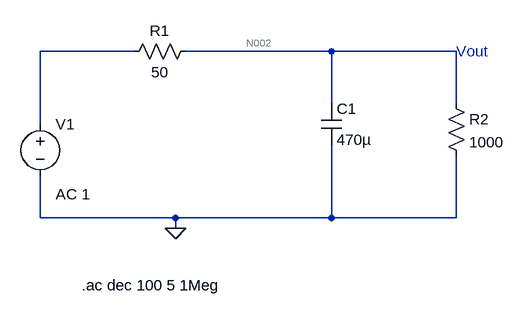
[diagram p0: schematic Shunt_filter.asc]
Shunt_filter.asc, the LTspice schematic file:
Version 4
SHEET 1 1188 680
WIRE 608 -16 464 -16
WIRE 912 -16 688 -16
WIRE 1104 -16 912 -16
WIRE 912 64 912 -16
WIRE 1104 64 1104 -16
WIRE 464 96 464 -16
WIRE 464 240 464 176
WIRE 672 240 464 240
WIRE 912 240 912 128
WIRE 912 240 672 240
WIRE 1104 240 1104 144
WIRE 1104 240 912 240
WIRE 672 256 672 240
FLAG 672 256 0
SYMBOL res 704 -32 R90
WINDOW 0 0 56 VBottom 2
WINDOW 3 32 56 VTop 2
SYMATTR InstName R1
SYMATTR Value 50
SYMBOL res 1088 48 R0
SYMATTR InstName R2
SYMATTR Value 1000
SYMBOL voltage 464 80 R0
WINDOW 123 24 124 Left 2
WINDOW 39 0 0 Left 0
SYMATTR InstName V1
SYMATTR Value ""
SYMATTR Value2 AC 1
SYMBOL cap 896 64 R0
SYMATTR InstName C1
SYMATTR Value 470µ
TEXT 1104 -16 Left 2 ;Vout
TEXT 528 344 Left 2 !.ac dec 100 5 1Meg

The netlist it stands for:
* Shunt_filter.asc
R1 N002 N001 50
R2 N002 0 1000
V1 N001 0 AC 1
C1 N002 0 470µ
* Vout
.ac dec 100 5 1Meg
.backanno
.end

* Results of the author's LTspice run, read from the files saved beside the schematic
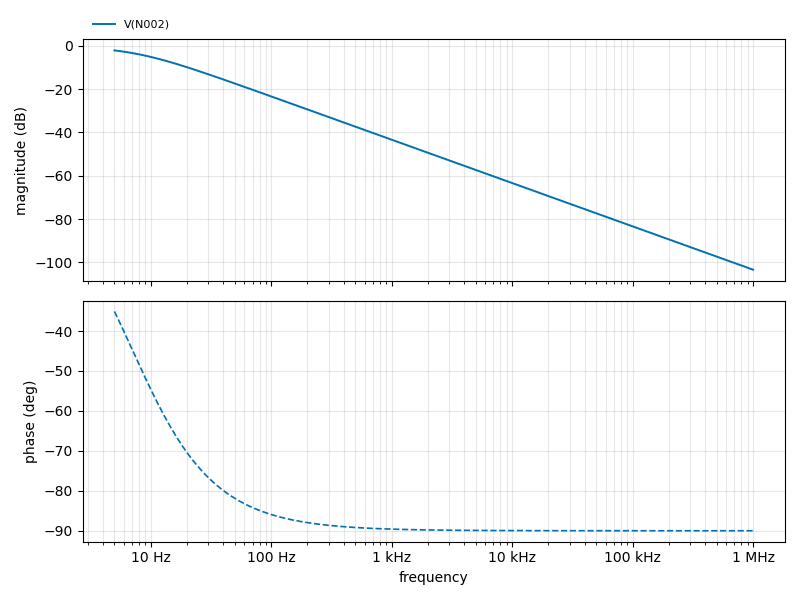
[diagram p1: AC Analysis of Shunt_filter.asc, plotted from the saved traces]
* AC Analysis, 1 run:
*   V(N002): -2.17 dB at 5 Hz, -103.38 dB at 1 MHz, peak -2.17 dB at 5 Hz, 3 dB below the peak at 10.03 Hz